# EAGLE schematic DIDV_-_Buck (EAGLE 6.2)
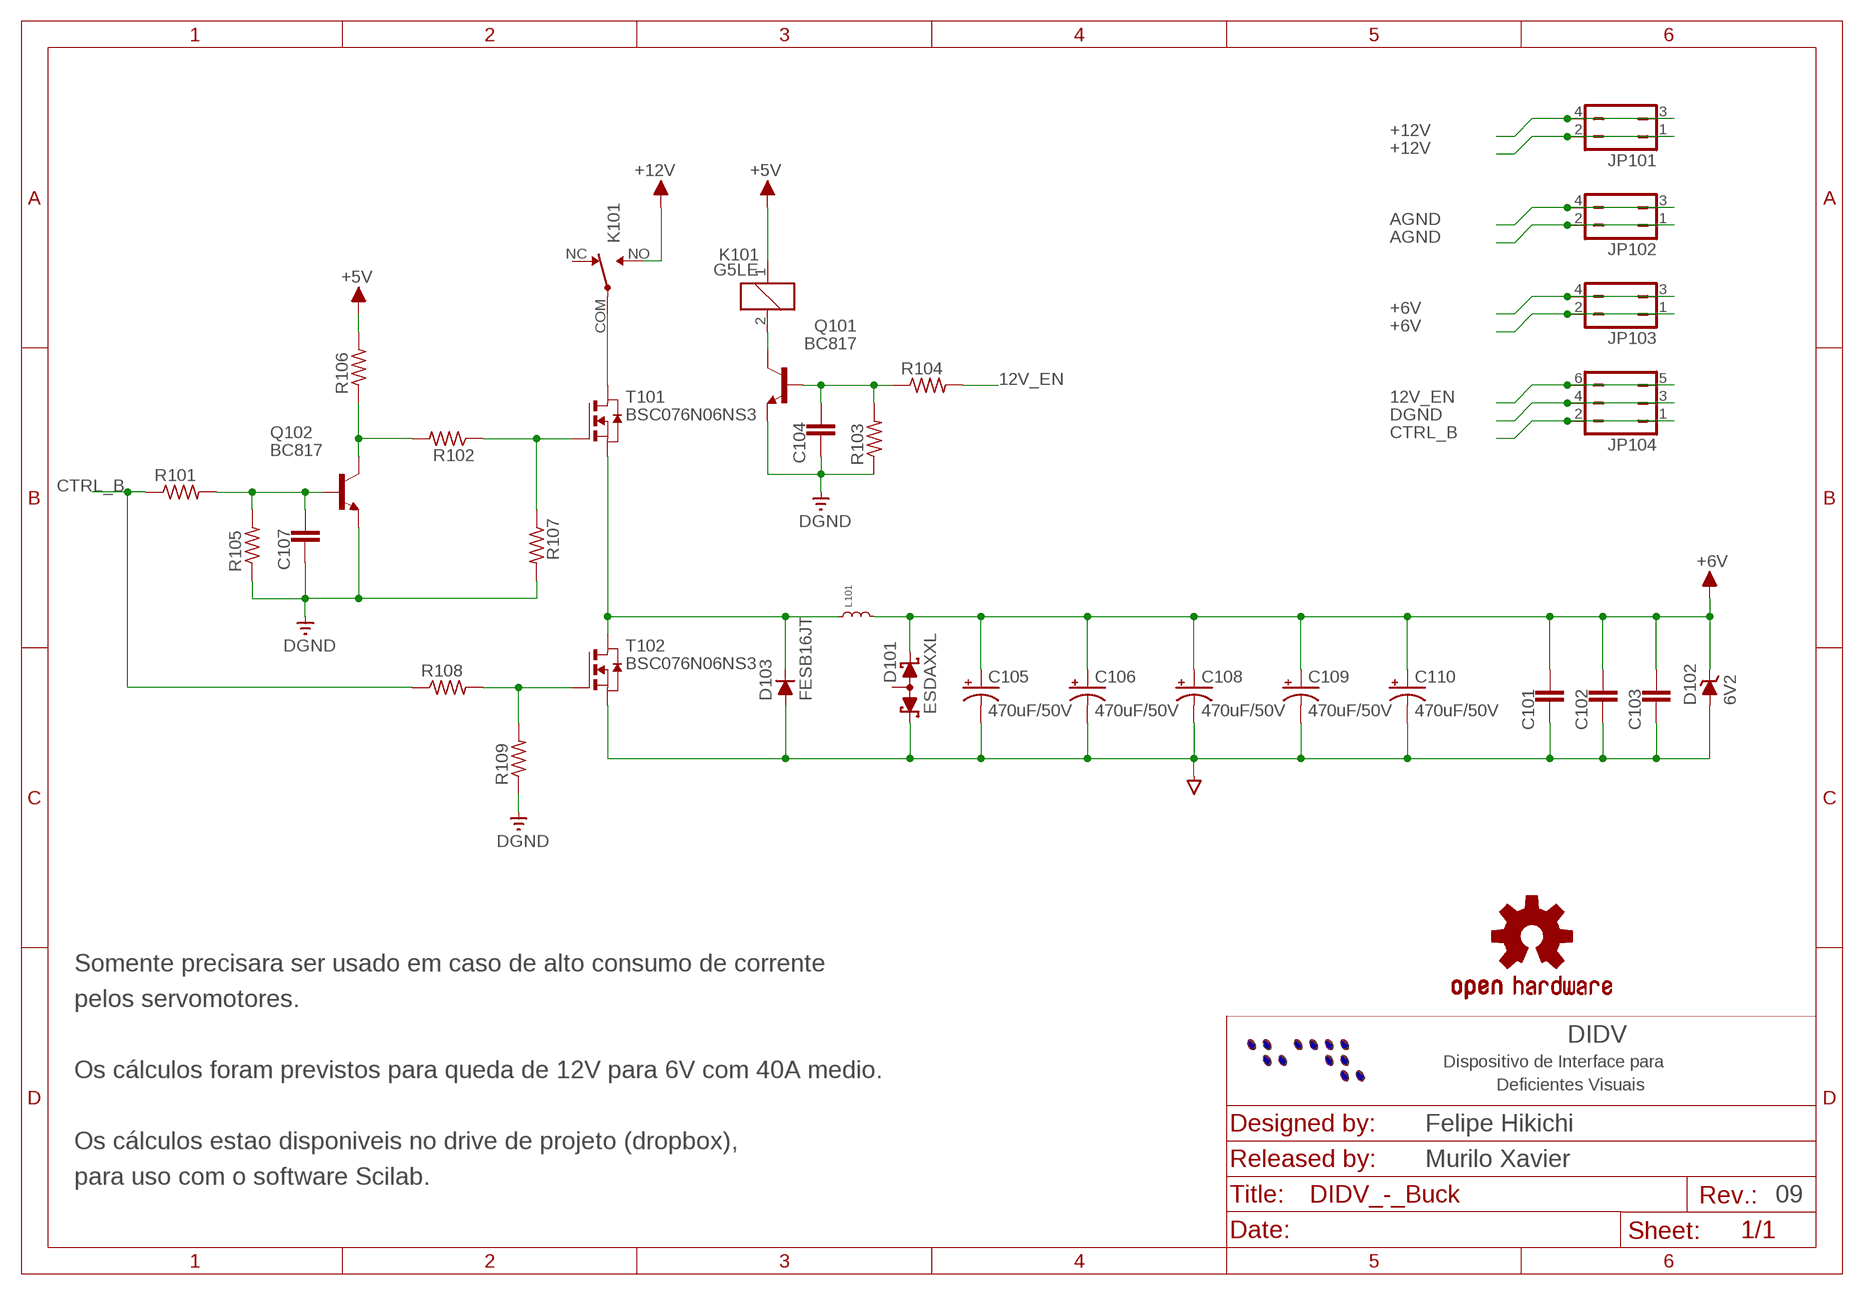
[diagram p0: schematic, sheet 1]

## Parts
C101  C-EUC0805  [C0805]
C102  C-EUC0805  [C0805]
C103  C-EUC0805  [C0805]
C104  C-EUC0603  [C0603]
C105  470uF/50V  CPOL-USE5-13  [E5-13]
C106  470uF/50V  CPOL-USE5-13  [E5-13]
C107  C-EUC0603  [C0603]
C108  470uF/50V  CPOL-USE5-13  [E5-13]
C109  470uF/50V  CPOL-USE5-13  [E5-13]
C110  470uF/50V  CPOL-USE5-13  [E5-13]
D101  ESDAXXL  [SOT23]
D102  6V2  BZX84  [SOT23]
D103  FESB16JT  MBRB745PBF  [D2PAK]
JP101  JP2QM  [JP2QM]
JP102  JP2QM  [JP2QM]
JP103  JP2QM  [JP2QM]
JP104  JP3QM  [JP3QM]
K101  G5LE  [G5LE]
L101  INDUCTOR  [SER2918H-682KL]
LOGO101  OSHW-LOGOL  [OSHW-LOGO-L]
Q101  BC817  BC817-16-NPN-SOT23-BEC  [SOT23-BEC]
Q102  BC817  BC817-16-NPN-SOT23-BEC  [SOT23-BEC]
R101  R-US_R0603  [R0603]
R102  R-US_R0805  [R0805]
R103  R-US_R0603  [R0603]
R104  R-US_R0603  [R0603]
R105  R-US_R0603  [R0603]
R106  R-US_R0805  [R0805]
R107  R-US_R0805  [R0805]
R108  R-US_R0805  [R0805]
R109  R-US_R0805  [R0805]
T101  BSC076N06NS3  BSC067N06LS3_G_PG-TDSON-8  [PG-TDSON-8]
T102  BSC076N06NS3  BSC067N06LS3_G_PG-TDSON-8  [PG-TDSON-8]

## Nets
12V_EN: JP104.5 JP104.6 R104.2
+5V: K101.1 R106.2
+6V: C101.1 C102.1 C103.1 C105.+ C106.+ C108.+ C109.+ C110.+ D101.2(C2) D102.3(C) JP103.1 JP103.2 JP103.3 JP103.4 L101.2
+12V: JP101.1 JP101.2 JP101.3 JP101.4 K101.NO(-A:NO)
AGND: C101.2 C102.2 C103.2 C105.- C106.- C108.- C109.- C110.- D101.1(C1) D102.1(A) D103.3(A) JP102.1 JP102.2 JP102.3 JP102.4 T102.1(S) T102.2(S) T102.3(S)
CTRL_B: JP104.1 JP104.2 R101.1 R108.1
DGND: C104.2 C107.2 JP104.3 JP104.4 Q101.E Q102.E R103.1 R105.1 R107.2 R109.1
N$1: K101.COM(-A:COM) T101.5(D) T101.6(D) T101.7(D) T101.8(D) T101.D
N$2: C104.1 Q101.B R103.2 R104.1
N$3: R102.1 R107.1 T101.4(G)
N$4: R108.2 R109.2 T102.4(G)
N$5: D103.1(C) D103.2(C) L101.1 T101.1(S) T101.2(S) T101.3(S) T102.5(D) T102.6(D) T102.7(D) T102.8(D) T102.D
N$6: C107.1 Q102.B R101.2 R105.2
N$7: Q102.C R102.2 R106.1
N$8: K101.2 Q101.C
Unconnected: D101.3(A) K101.NC(-A:NC)

## Notes on the sheet
- Somente precisara ser usado em caso de alto consumo de corrente
- pelos servomotores.
- DIDV
- Dispositivo de Interface para
- Os cálculos foram previstos para queda de 12V para 6V com 40A medio.
- Deficientes Visuais
- Felipe Hikichi
- Os cálculos estao disponiveis no drive de projeto (dropbox),
- Murilo Xavier
- para uso com o software Scilab.
- 09

## Library data of the parts
C101-C104 C107 = rcl:C-EU: CAPACITOR, European symbol
C105 C106 C108-C110 = rcl:CPOL-US: POLARIZED CAPACITOR, American symbol
D101 = diode:ESDAXXL: DUAL TRANSIL ARRAY
D102 = diode:BZX84: Z DIODE
D103 = diode:MBRB745PBF: SCHOTTKY DIODE
JP101-JP103 = jumper:JP2Q: JUMPER
JP104 = jumper:JP3Q: JUMPER
K101 = relay:G5LE: RELAY 1 x switch, 10 A/120 V AC, 8 A/30 V DC, Omron
L101 = coilcraft:INDUCTOR
LOGO101 = OpenHW_BOT:OSHW-LOGO: Open Source Hardware Logo This logo indicates the piece of hardware it is found on incorporates a OSHW license and/or adheres to the definition of open source hardware found here: http://freedomdefined.org/OSHW
Q101 Q102 = transistor:*-NPN-: NPN Transistror
R101-R109 = rcl:R-US_: RESISTOR, American symbol
T101 T102 = PG-TDSON-8:BSC067N06LS3_G_PG-TDSON-8